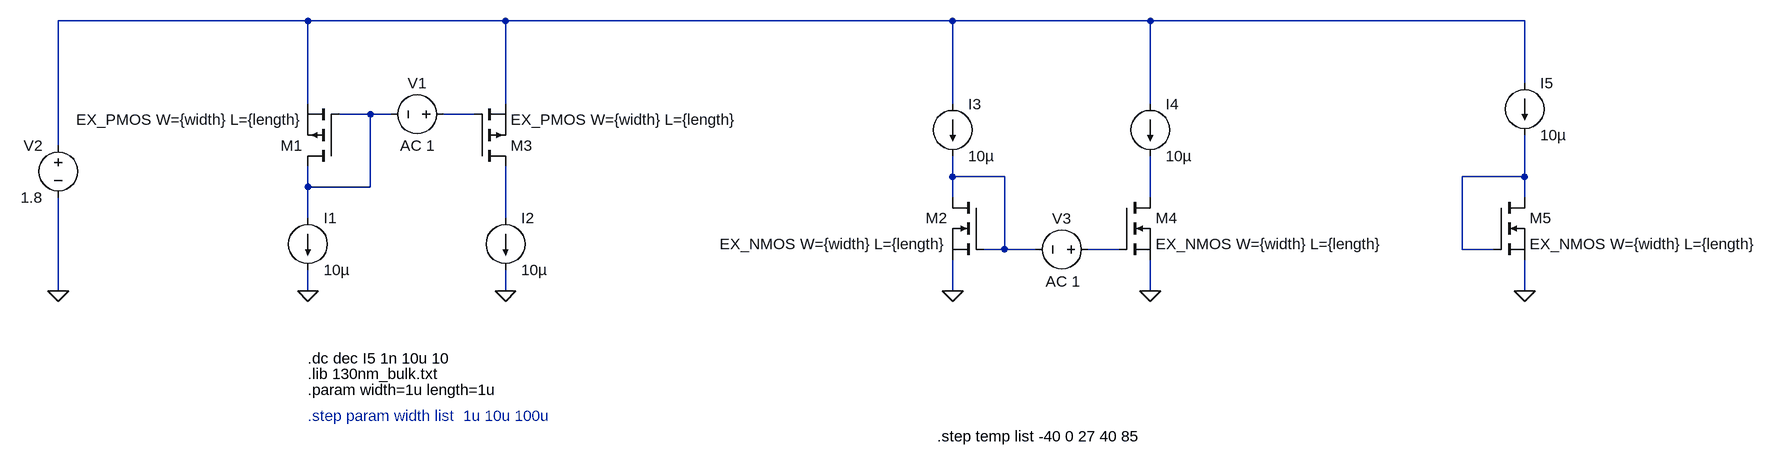
[diagram p0: schematic characterize_models.asc]
characterize_models.asc, the LTspice schematic file:
Version 4
SHEET 1 2412 680
WIRE 128 -240 -256 -240
WIRE 432 -240 128 -240
WIRE 1120 -240 432 -240
WIRE 1424 -240 1120 -240
WIRE 2000 -240 1424 -240
WIRE 2000 -144 2000 -240
WIRE 128 -112 128 -240
WIRE 432 -112 432 -240
WIRE 1120 -112 1120 -240
WIRE 1424 -112 1424 -240
WIRE 224 -96 176 -96
WIRE 256 -96 224 -96
WIRE 384 -96 336 -96
WIRE -256 -48 -256 -240
WIRE 1120 0 1120 -32
WIRE 1200 0 1120 0
WIRE 2000 0 2000 -64
WIRE 2000 0 1904 0
WIRE 128 16 128 -16
WIRE 224 16 224 -96
WIRE 224 16 128 16
WIRE 1120 32 1120 0
WIRE 1424 32 1424 -32
WIRE 2000 32 2000 0
WIRE 128 64 128 16
WIRE 432 64 432 -16
WIRE 1200 112 1200 0
WIRE 1200 112 1168 112
WIRE 1248 112 1200 112
WIRE 1376 112 1328 112
WIRE 1904 112 1904 0
WIRE 1952 112 1904 112
WIRE -256 176 -256 32
WIRE 128 176 128 144
WIRE 432 176 432 144
WIRE 1120 176 1120 128
WIRE 1424 176 1424 128
WIRE 2000 176 2000 128
FLAG 128 176 0
FLAG -256 176 0
FLAG 432 176 0
FLAG 1120 176 0
FLAG 1424 176 0
FLAG 2000 176 0
SYMBOL pmos 176 -16 R180
SYMATTR InstName M1
SYMATTR Value EX_PMOS W={width} L={length}
SYMBOL nmos 1168 32 M0
SYMATTR InstName M2
SYMATTR Value EX_NMOS W={width} L={length}
SYMBOL current 128 64 R0
WINDOW 123 0 0 Left 0
WINDOW 39 0 0 Left 0
SYMATTR InstName I1
SYMATTR Value 10µ
SYMBOL voltage 352 -96 R90
WINDOW 0 -32 56 VBottom 2
WINDOW 3 32 56 VTop 2
WINDOW 123 64 55 VBottom 2
WINDOW 39 0 0 Left 0
SYMATTR InstName V1
SYMATTR Value ""
SYMATTR Value2 AC 1
SYMBOL voltage -256 -64 M0
WINDOW 123 0 0 Left 0
WINDOW 39 0 0 Left 0
SYMATTR InstName V2
SYMATTR Value 1.8
SYMBOL pmos 384 -16 M180
SYMATTR InstName M3
SYMATTR Value EX_PMOS W={width} L={length}
SYMBOL current 432 64 R0
WINDOW 123 0 0 Left 0
WINDOW 39 0 0 Left 0
SYMATTR InstName I2
SYMATTR Value 10µ
SYMBOL current 1120 -112 R0
WINDOW 123 0 0 Left 0
WINDOW 39 0 0 Left 0
SYMATTR InstName I3
SYMATTR Value 10µ
SYMBOL current 1424 -112 R0
WINDOW 123 0 0 Left 0
WINDOW 39 0 0 Left 0
SYMATTR InstName I4
SYMATTR Value 10µ
SYMBOL nmos 1376 32 R0
SYMATTR InstName M4
SYMATTR Value EX_NMOS W={width} L={length}
SYMBOL voltage 1344 112 R90
WINDOW 0 -32 56 VBottom 2
WINDOW 3 32 56 VTop 2
WINDOW 123 34 54 VTop 2
WINDOW 39 0 0 Left 0
SYMATTR InstName V3
SYMATTR Value ""
SYMATTR Value2 AC 1
SYMBOL nmos 1952 32 R0
SYMATTR InstName M5
SYMATTR Value EX_NMOS W={width} L={length}
SYMBOL current 2000 -144 R0
WINDOW 123 0 0 Left 0
WINDOW 39 0 0 Left 0
SYMATTR InstName I5
SYMATTR Value 10µ
TEXT 128 304 Left 2 !.lib 130nm_bulk.txt
TEXT 128 280 Left 2 !.dc dec I5 1n 10u 10
TEXT 128 328 Left 2 !.param width=1u length=1u
TEXT 128 368 Left 2 ;.step param width list  1u 10u 100u
TEXT 1096 400 Left 2 !.step temp list -40 0 27 40 85

The netlist it stands for:
* characterize_models.asc
M1 N002 N002 N001 N001 EX_PMOS W={width} L={length}
M2 N004 N004 0 0 EX_NMOS W={width} L={length}
I1 N002 0 10µ
V1 N003 N002 AC 1
V2 N001 0 1.8
M3 N007 N003 N001 N001 EX_PMOS W={width} L={length}
I2 N007 0 10µ
I3 N001 N004 10µ
I4 N001 N006 10µ
M4 N006 N008 0 0 EX_NMOS W={width} L={length}
V3 N008 N004 AC 1
M5 N005 N005 0 0 EX_NMOS W={width} L={length}
I5 N001 N005 10µ
.model NMOS NMOS
.model PMOS PMOS
.lib standard.mos
.lib 130nm_bulk.txt
.dc dec I5 1n 10u 10
.param width=1u length=1u
* .step param width list  1u 10u 100u
.step temp list -40 0 27 40 85
.backanno
.end